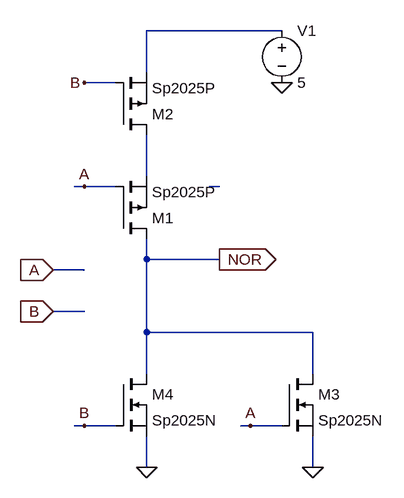
[diagram p0: schematic NOR.asc]
NOR.asc, the LTspice schematic file:
Version 4
SHEET 1 880 680
WIRE 432 -320 224 -320
WIRE 224 -256 224 -320
WIRE 176 -240 128 -240
WIRE 224 -96 224 -160
WIRE 128 -80 112 -80
WIRE 176 -80 128 -80
WIRE 336 -80 320 -80
WIRE 224 32 224 0
WIRE 336 32 224 32
WIRE 128 48 80 48
WIRE 128 112 80 112
WIRE 224 144 224 32
WIRE 480 144 224 144
WIRE 224 208 224 144
WIRE 480 208 480 144
WIRE 128 288 112 288
WIRE 176 288 128 288
WIRE 384 288 368 288
WIRE 432 288 384 288
WIRE 224 352 224 304
WIRE 480 352 480 304
FLAG 224 352 0
FLAG 80 48 A
IOPIN 80 48 In
FLAG 80 112 B
IOPIN 80 112 In
FLAG 384 288 A
FLAG 128 288 B
FLAG 128 -80 A
FLAG 128 -240 B
FLAG 336 32 NOR
IOPIN 336 32 Out
FLAG 480 352 0
FLAG 432 -240 0
SYMBOL pmos 176 0 M180
SYMATTR InstName M1
SYMATTR Value Sp2025P
SYMBOL pmos 176 -160 M180
SYMATTR InstName M2
SYMATTR Value Sp2025P
SYMBOL nmos 432 208 R0
SYMATTR InstName M3
SYMATTR Value Sp2025N
SYMBOL nmos 176 208 R0
SYMATTR InstName M4
SYMATTR Value Sp2025N
SYMBOL voltage 432 -336 R0
SYMATTR InstName V1
SYMATTR Value 5

The netlist it stands for:
* NOR.asc
M1 NOR A N002 N002 Sp2025P
M2 N002 B N001 N001 Sp2025P
M3 NOR A 0 0 Sp2025N
M4 NOR B 0 0 Sp2025N
V1 N001 0 5
.model NMOS NMOS
.model PMOS PMOS
.lib standard.mos
.backanno
.end